# Altium schematic sheet VCO_schematic.SchDoc
size A4; SheetNumber: 1; SheetTotal: 1
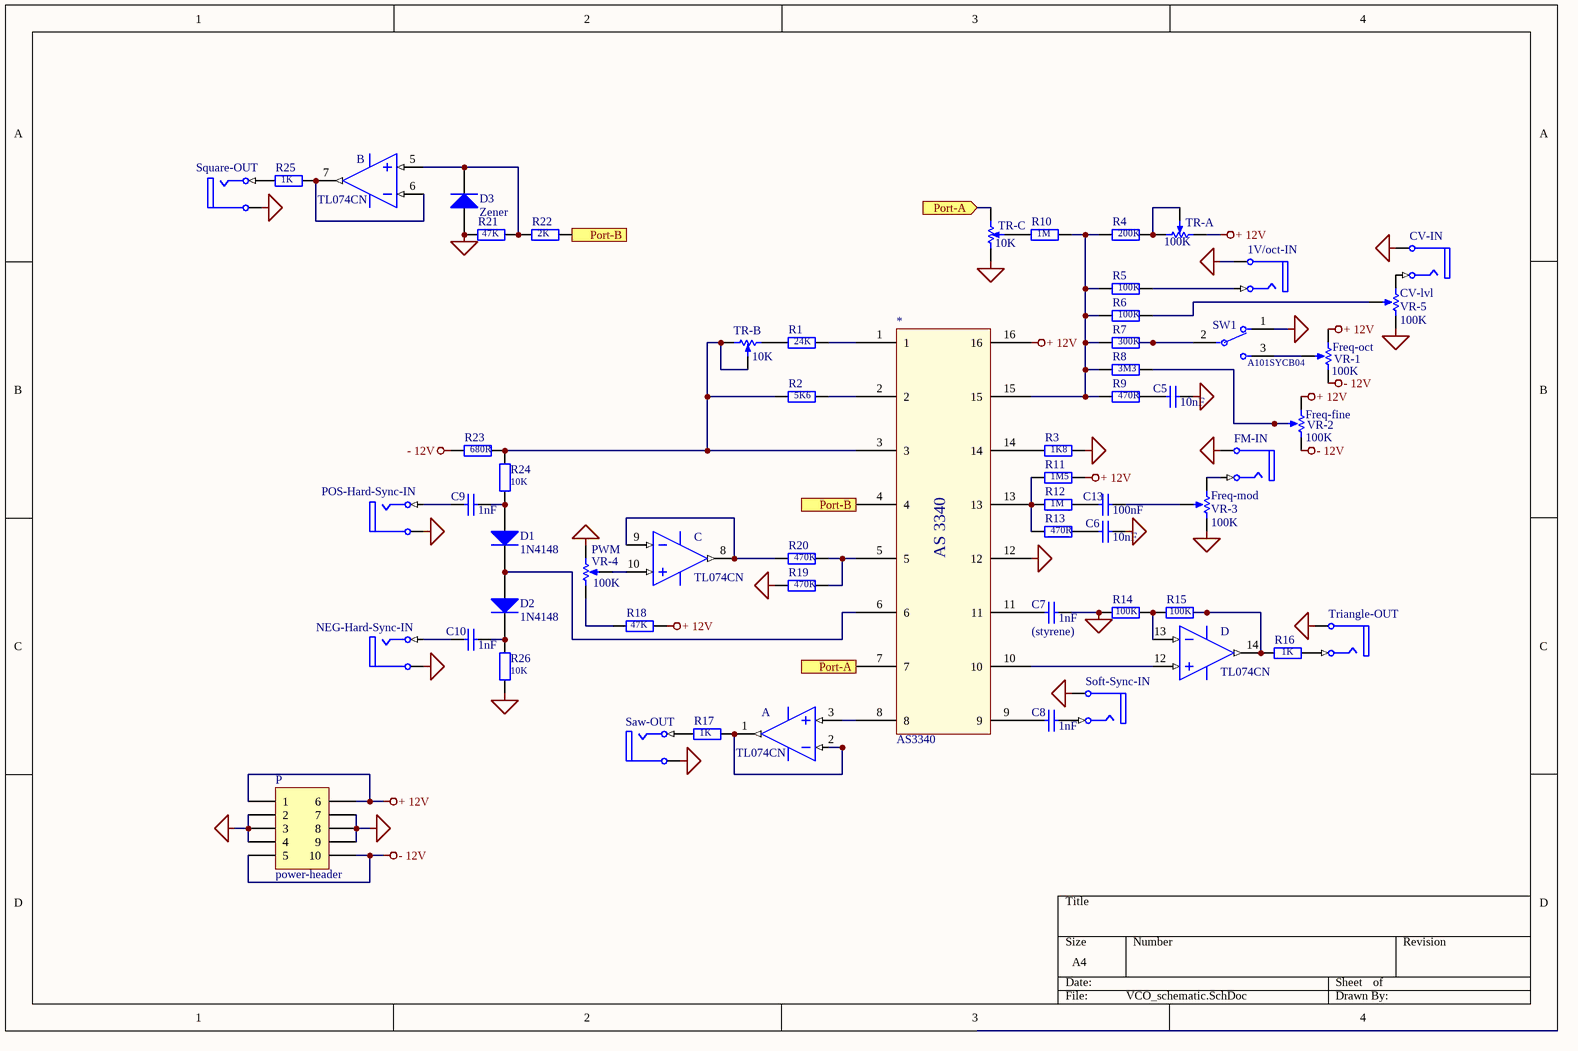
[diagram p0: VCO_schematic.SchDoc]

## Parts
(Parts that share a designator on the sheet are numbered #1, #2 ... from top to bottom, then left to right.)
1V/oct-IN  (no value)  [PCBComponent_1]
*  AS3340  [DIP16-AS3340]
?#1  TL074CN  [N0014A]  (part B of 4)
?#2  TL074CN  [N0014A]  (part C of 4)
?#3  TL074CN  [N0014A]  (part D of 4)
?#4  TL074CN  [N0014A]  (part A of 4)
C5  value 10nF  [RAD-0.3]
C6  value 10nF  [RAD-0.3]
C7  (styrene)  value 1nF  [RAD-0.3]
C8  value 1nF  [RAD-0.3]
C9  value 1nF  [RAD-0.3]
C10  value 1nF  [RAD-0.3]
C13  value 100nF  [RAD-0.3]
CV-IN  (no value)  [PCBComponent_1]
CV-lvl  VR-5  value 100K  [PCBComponent_1]
D1  1N4148  [DO-35]
D2  1N4148  [DO-35]
D3  Zener  [DO-35]
FM-IN  (no value)  [PCBComponent_1]
Freq-fine  VR-2  value 100K  [PCBComponent_1]
Freq-mod  VR-3  value 100K  [PCBComponent_1]
Freq-oct  VR-1  value 100K  [PCBComponent_1]
NEG-Hard-Sync-IN  (no value)  [PCBComponent_1]
P  power-header  [HDR2X5_CEN]
POS-Hard-Sync-IN  (no value)  [PCBComponent_1]
PWM  VR-4  value 100K  [PCBComponent_1]
R1  value 24K  [AXIAL-0.4]
R2  value 5K6  [AXIAL-0.4]
R3  value 1K8  [AXIAL-0.4]
R4  value 200K  [AXIAL-0.4]
R5  value 100K  [AXIAL-0.4]
R6  value 100K  [AXIAL-0.4]
R7  value 300K  [AXIAL-0.4]
R8  value 3M3  [AXIAL-0.4]
R9  value 470R  [AXIAL-0.4]
R10  value 1M  [AXIAL-0.4]
R11  value 1M5  [AXIAL-0.4]
R12  value 1M  [AXIAL-0.4]
R13  value 470R  [AXIAL-0.4]
R14  value 100K  [AXIAL-0.4]
R15  value 100K  [AXIAL-0.4]
R16  value 1K  [AXIAL-0.4]
R17  value 1K  [AXIAL-0.4]
R18  value 47K  [AXIAL-0.4]
R19  value 470K  [AXIAL-0.4]
R20  value 470K  [AXIAL-0.4]
R21  value 47K  [AXIAL-0.4]
R22  value 2K  [AXIAL-0.4]
R23  value 680R  [AXIAL-0.4]
R24  value 10K  [AXIAL-0.4]
R25  value 1K  [AXIAL-0.4]
R26  value 10K  [AXIAL-0.4]
Saw-OUT  (no value)  [PCBComponent_1]
Soft-Sync-IN  (no value)  [PCBComponent_1]
Square-OUT  (no value)  [PCBComponent_1]
SW1  A101SYCB04  [FP-A101SYCB04-MFG]
TR-A  100K  [PCBComponent_1]
TR-B  10K  [PCBComponent_1]
TR-C  10K  [PCBComponent_1]
Triangle-OUT  (no value)  [PCBComponent_1]

## Ports
Port-A (in), Port-A (out), Port-B (in), Port-B (out)

## Nets
+ 12V: *.16 Freq-fine.1(TOP) Freq-oct.1(TOP) P.1 P.6 R11.2 R18.1 TR-A.CCW(-)
- 12V: Freq-fine.2(BOT) Freq-oct.2(BOT) P.5 P.10 R23.1
Net1V/oct-IN_5: 1V/oct-IN.5(S) *.12 C5.2 C6.2 C7.2 CV-IN.5(S) CV-lvl.2(BOT) D3.1(A) FM-IN.5(S) Freq-mod.2(BOT) NEG-Hard-Sync-IN.5(S) P.2 P.3 P.4 P.7 P.8 P.9 POS-Hard-Sync-IN.5(S) PWM.2(BOT) R3.2 R14.1 R19.1 R21.2 R26.2 Saw-OUT.5(S) Soft-Sync-IN.5(S) Square-OUT.5(S) SW1.1 TR-C.CCW(-) Triangle-OUT.5(S)
Port-A: *.7 TR-C.CW(+) ; port Port-A
Port-B: *.4 R22.2 ; port Port-B
Net1V/oct-IN_1: 1V/oct-IN.1(T) R5.2
Net*_1: *.1 R1.2
Net*_2: *.2 R2.2
Net*_3: *.3 R2.1 R23.2 R24.1 TR-B.CCW(-) TR-B.W
Net*_5: *.5 R19.2 R20.2
Net*_6: *.6 D1.2(K) D2.1(A)
Net*_8: *.8 ?#4.3(IN1+)
Net*_9: *.9 C8.1
Net*_10: *.10 ?#3.12(IN4+)
Net*_11: *.11 C7.1
Net*_13: *.13 R11.1 R12.1 R13.1
Net*_14: *.14 R3.1
Net*_15: *.15 R4.1 R5.1 R6.1 R7.1 R8.1 R9.1 R10.2
Net?#1_5: ?#1.5(IN2+) D3.2(K) R21.1 R22.1
Net?#1_6: ?#1.6(IN2-) ?#1.7(OUT2) R25.2
Net?#2_8: ?#2.8(OUT3) ?#2.9(IN3-) R20.1
Net?#2_10: ?#2.10(IN3+) PWM.3(TAP)
Net?#3_13: ?#3.13(IN4-) R14.2 R15.1
Net?#3_14: ?#3.14(OUT4) R15.2 R16.1
Net?#4_1: ?#4.1(OUT1) ?#4.2(IN1-) R17.2
NetC5_1: C5.1 R9.2
NetC6_1: C6.1 R13.2
NetC8_2: C8.2 Soft-Sync-IN.1(T)
NetC9_1: C9.1 POS-Hard-Sync-IN.1(T)
NetC9_2: C9.2 D1.1(A) R24.2
NetC10_1: C10.1 NEG-Hard-Sync-IN.1(T)
NetC10_2: C10.2 D2.2(K) R26.1
NetC13_1: C13.1 R12.2
NetC13_2: C13.2 Freq-mod.3(TAP)
NetCV-IN_1: CV-IN.1(T) CV-lvl.1(TOP)
NetCV-lvl_3: CV-lvl.3(TAP) R6.2
NetFM-IN_1: FM-IN.1(T) Freq-mod.1(TOP)
NetFreq-fine_3: Freq-fine.3(TAP) R8.2
NetFreq-oct_3: Freq-oct.3(TAP) SW1.3
NetPWM_1: PWM.1(TOP) R18.2
NetR1_1: R1.1 TR-B.CW(+)
NetR4_2: R4.2 TR-A.CW(+) TR-A.W
NetR7_2: R7.2 SW1.2
NetR10_1: R10.1 TR-C.W
NetR16_2: R16.2 Triangle-OUT.1(T)
NetR17_1: R17.1 Saw-OUT.1(T)
NetR25_1: R25.1 Square-OUT.1(T)

Not connected (* = marked no-connect by the designer): ?#1 4(VCC+) 11(VCC-); ?#2 4(VCC+) 11(VCC-); ?#3 4(VCC+) 11(VCC-); ?#4 4(VCC+) 11(VCC-)

## Notes on the sheet
- (in symbol AS3340) AS 3340

## Library data of the parts
1V/oct-IN CV-IN FM-IN NEG-Hard-Sync-IN POS-Hard-Sync-IN Saw-OUT Soft-Sync-IN Square-OUT Triangle-OUT = Phonejack2: Jack Socket, 1/4" [6.5mm], Thru-Hole, Vertical, 2-Conductor Open Circuit; pin to pad: 1>2 5>4; PackageDocument: 2003; PCB_Layout: Complies with manufacturer's recommendation.; DrillAndSlotSize: Corresponds to nominal value.; LatestRevisionDate: 15-Jul-2004; LatestRevisionNote: Component Replaced.; DatasheetDocument: 2003; PackageReference: S1VS_SNS; Publisher: Altium Limited; ComponentLink1Description: Manufacturer Link; ComponentLink1URL: http://www.cliffuk.co.uk/
?#1-?#4 = CMP-0015-00129-2: Quad Low-Noise JFET-Input General-Purpose Operational Amplifier, 7 to 36 V, 0 to 70 degC, 14-pin DIP (N14), Pb-Free (RoHS); Manufacturer: Texas Instruments; Rating: Military; Total Supply Voltage(Max)(+5V is 5, +/-5V is 10): 36; IIB(Max)(pA): 200; Number of Channels: 4; Sub Family: General Purpose Amplifier, High Supply Voltage Amplifier (>=30V); Vio (25C)(Max)(mV): 10; Iq per channel(Max)(mA): 2.5; Total Supply Voltage(Min)(+5V is 5, +/-5V is 10): 7; Vn at 1kHz(Typ)(nV/rtHz): 18; Slew Rate(Typ)(V/us): 13; GBW(Typ)(MHz): 3; CMRR(Min)(dB): 70; DatasheetVersion: SLOS080J; ComponentLink2Description: Datasheet; ComponentLink2URL: http://www.ti.com/lit/ds/symlink/tl074.pdf; ComponentLink3URL: http://www.ti.com/lit/ml/mpdi002c/mpdi002c.pdf; PackageDescription: 14-Pin Plastic In-Line, Body 19.305 x 6.35 mm, Pitch 2.54 mm; Eco-Plan: Pb-Free (RoHS); ComponentLink1Description: Manufacturer URL; PackageReference: N0014A; ComponentLink3Description: Package Specification; Mounting Technology: Through Hole; PackageVersion: 4040049/E, 12/2002; PartNumber: TL074CN; ComponentLink1URL: http://www.ti.com/; Offset Drift(Typ)(uV/C): 18; Code_JEDEC: MS-001
C5-C10 C13 = Cap: Capacitor; Published: 8-Jun-2000; LatestRevisionDate: 17-Jul-2002; LatestRevisionNote: Re-released for DXP Platform.; PackageReference: RAD-0.3; Publisher: Altium Limited; PackageDescription: Radial Cap, Thru-Hole; 2 Leads; 0.3 in Pin Spacing
CV-lvl Freq-fine Freq-mod Freq-oct PWM = RPot: Potentiometer; Sim Note: Enter the Resistance value and the set point into parameter fields.; Set Position: 0.5; Published: 8-Jun-2000; LatestRevisionDate: 17-Jul-2002; LatestRevisionNote: Re-released for DXP Platform.; PackageReference: VR5; Publisher: Altium Limited; PackageDescription: Variable Resistor, Thru-Hole; 3 Leads
D1-D3 = Diode 1N4148: High Conductance Fast Diode; Published: 8-Jun-2000; LatestRevisionDate: 17-Jul-2002; LatestRevisionNote: Re-released for DXP Platform.; DatasheetVersion: 1997; PackageReference: DO-35; Publisher: Altium Limited; PackageDescription: Diode, Axial; Body 3.8 x 1.9 mm (LxDia. max), Lead Dia. 0.53 mm (max); Code_JEDEC: DO-204-AH; ComponentLink1Description: Manufacturer Link; ComponentLink1URL: http://www.fairchildsemi.com/; ComponentLink2Description: Datasheet; ComponentLink2URL: http://www.fairchildsemi.com/ds/1N%2F1N4148.pdf
P = Header 5X2A: Header, 5-Pin, Dual row; LatestRevisionDate: 17-Jul-2002; LatestRevisionNote: Re-released for DXP Platform.; Publisher: Altium Limited
R1-R26 = Res2: Resistor; Published: 8-Jun-2000; LatestRevisionDate: 17-Jul-2002; LatestRevisionNote: Re-released for DXP Platform.; PackageReference: AXIAL-0.4; Publisher: Altium Limited; PackageDescription: Axial Device, Thru-Hole; 2 Leads; 0.4 in Pin Spacing
SW1 = CMP-03408-000017-1: SWITCH TOGGLE SPDT 0.4VA 20V; Electrical Life: 6000Cycles; Number of Poles: 1; Power Rating: 400mW; Switch Function: On-On; Contact Resistance: 10mR; Contact Current Rating: 400mA; Actuator Material: Phenolic; Insulation Resistance: 30MR; Actuator Color: Chrome; Number of Positions: 2; Actuator Type: Standard Round; Actuator Length: 10.41mm; Illumination Type: Non-Illuminated; Flammability Rating: UL94 V-1; Contact Material: Copper; Depth: 6.86mm; Contact Plating: Gold; Voltage Rating (AC): 20V; Max Voltage Rating (DC): 20V; Min Operating Temperature: -30°C; Max Operating Temperature: 85°C; Throw Configuration: SPDT; Packaging: Bulk; Termination: PC Pins; Series: Gemini A; ELV: Compliant; Lead Free: Lead Free; RoHS Compliant: Yes; REACH SVHC: No SVHC; Mount: Panel; Orientation: Straight; Package Quantity: 100; Max Voltage Rating (AC): 20V; Radiation Hardening: No; Voltage Rating (DC): 20V
TR-A TR-B TR-C = RPot SM: Square Trimming Potentiometer; pin to pad: CCW>1 CW>3 W>2; Published: 17-Dec-2003; DatasheetVersion: Oct-2003; PackageReference: POT4MM-2; Publisher: Altium Limited; PackageDescription: Square Trimming Potentiometer; ComponentLink1Description: Manufacturer Link; ComponentLink1URL: http://bourns.com/2/search.html